# Altium schematic sheet 4G.SchDoc
size A2
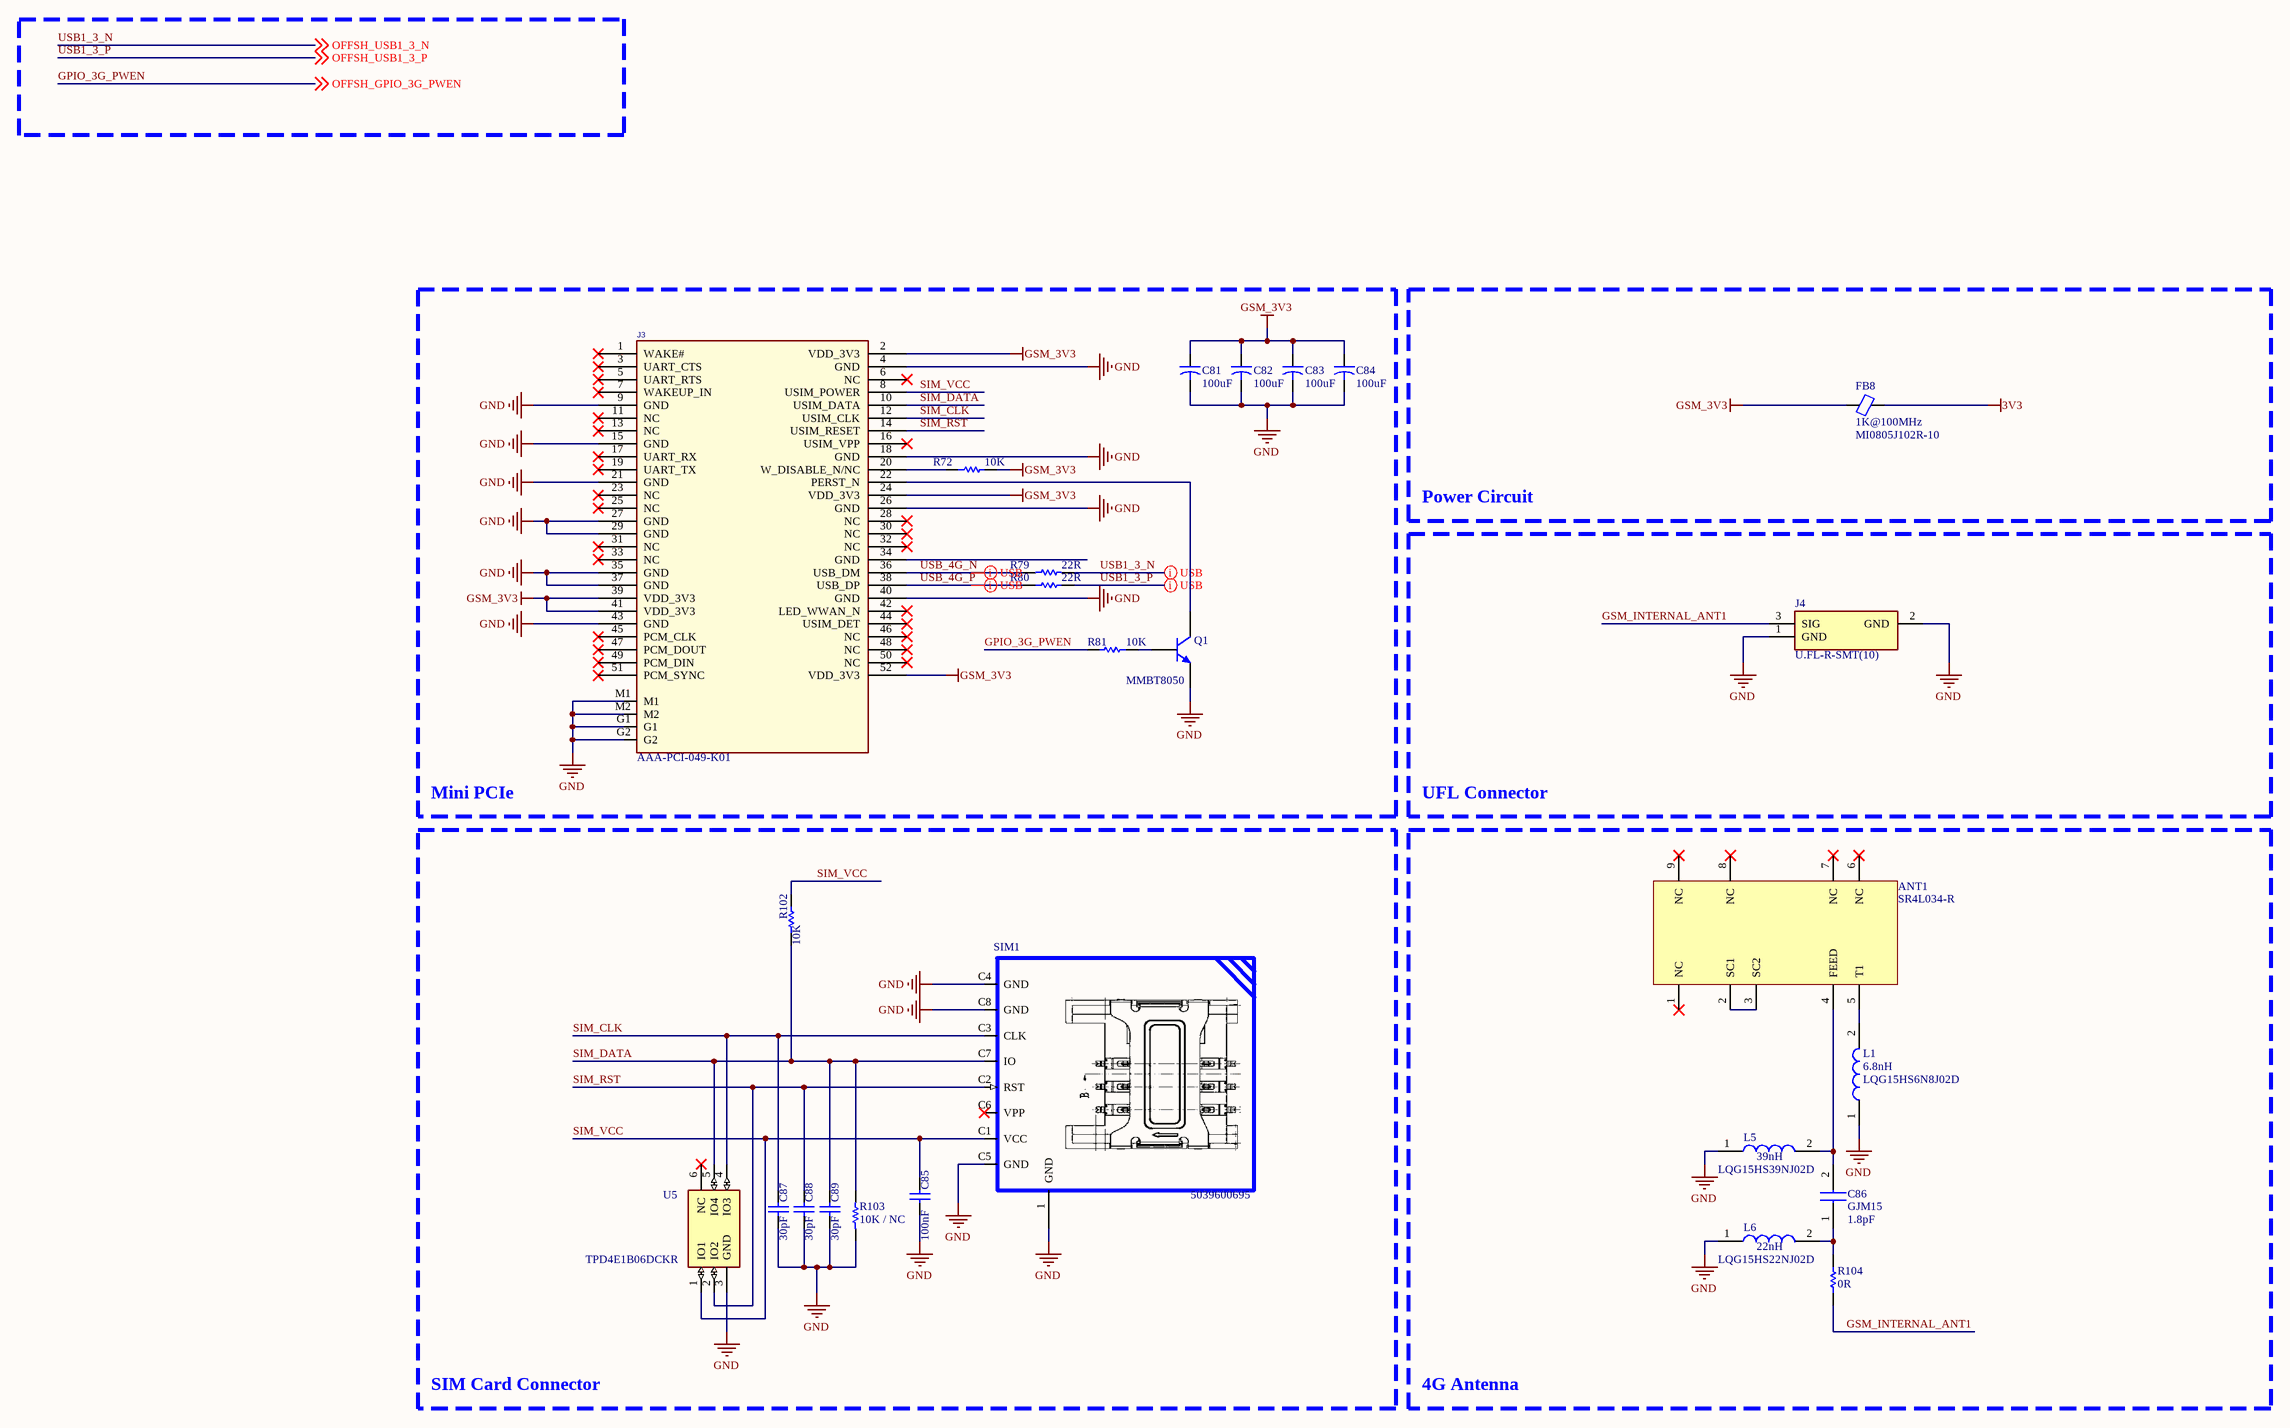
[diagram p0: 4G.SchDoc]

## Parts
ANT1  4G Antenna  [SR4L034-R]  (value not drawn)
C81  value 100uF  [TANTAL (SIZE B)]  (hidden comment: Cap_Tantal)
C82  value 100uF  [TANTAL (SIZE B)]  (hidden comment: Cap_Tantal)
C83  value 100uF  [TANTAL (SIZE B)]  (hidden comment: Cap_Tantal)
C84  value 100uF  [TANTAL (SIZE B)]  (hidden comment: Cap_Tantal)
C85  value 100nF  [CAP (0603)]  (hidden comment: Cap)
C86  GJM15  value 1.8pF  [GJM15]
C87  value 30pF  [CAP (0603)]  (hidden comment: Cap)
C88  value 30pF  [CAP (0603)]  (hidden comment: Cap)
C89  value 30pF  [CAP (0603)]  (hidden comment: Cap)
FB8  value 1K@100MHz  Part Number: MI0805J102R-10  [FB0603]  (hidden comment: Ferrite Bead)
J3  Part Number: AAA-PCI-049-K01  [MINI PCIE]  (hidden comment: Mini PCIe)
J4  U.FL  [UFLRSMT10]  (value not drawn)
L1  value 6.8nH  [LQG15HN]  (hidden comment: LQG15HS6N8J02D)
L5  value 39nH  [LQG15HN]  (hidden comment: LQG15HS39NJ02D)
L6  value 22nH  [LQG15HN]  (hidden comment: LQG15HS22NJ02D)
Q1  MMBT8050  [SOT95P237X111-3N (SOT23)]
R72  value 10K  [RES (0603)]  (hidden comment: Res)
R79  value 22R  [RES (0603)]  (hidden comment: Res)
R80  value 22R  [RES (0603)]  (hidden comment: Res)
R81  value 10K  [RES (0603)]  (hidden comment: Res)
R102  value 10K  [RES (0603)]  (hidden comment: Res)
R103  value 10K / NC  [RES (0603)]  (hidden comment: Res)
R104  value 0R  [RES (0603)]  (hidden comment: Res)
SIM1  Part Number: 5039600695  [Micro SIM Connector (5039600695)]  (hidden comment: Micro SIM Connector)
U5  ESD Protection  [SOT65P210X110-6N (SC70 6L)]  (value not drawn)

## Nets
3V3: FB8.2
GND: C81.2 C82.2 C83.2 C84.2 C85.1 C87.1 C88.1 C89.1 J3.4(GND) J3.9(GND) J3.15(GND) J3.18(GND) J3.21(GND) J3.26(GND) J3.27(GND) J3.29(GND) J3.35(GND) J3.37(GND) J3.40(GND) J3.43(GND) J3.G1 J3.G2 J3.M1 J3.M2 J4.1(GND) J4.2(GND) L1.1 L5.1 L6.1 Q1.2(E) R103.1 SIM1.1(GND) SIM1.C4(GND) SIM1.C5(GND) SIM1.C8(GND) U5.3(GND)
GSM_3V3: C81.1 C82.1 C83.1 C84.1 FB8.1 J3.2(VDD_3V3) J3.24(VDD_3V3) J3.39(VDD_3V3) J3.41(VDD_3V3) J3.52(VDD_3V3) R72.2
GPIO_3G_PWEN: R81.2 ; off-sheet OFFSH_GPIO_3G_PWEN  [also labelled OFFSH_GPIO_3G_PWEN]
GSM_INTERNAL_ANT1: J4.3(SIG) R104.1
SIM_CLK: C87.2 J3.12(USIM_CLK) SIM1.C3(CLK) U5.4(IO3)
SIM_DATA: C89.2 J3.10(USIM_DATA) R102.1 R103.2 SIM1.C7(IO) U5.5(IO4)
SIM_RST: C88.2 J3.14(USIM_RESET) SIM1.C2(RST) U5.2(IO2)
SIM_VCC: C85.2 J3.8(USIM_POWER) R102.2 SIM1.C1(VCC) U5.1(IO1)
USB1_3_N: R79.2 ; off-sheet OFFSH_USB1_3_N  [also labelled OFFSH_USB1_3_N]
USB1_3_P: R80.2 ; off-sheet OFFSH_USB1_3_P  [also labelled OFFSH_USB1_3_P]
USB_4G_N: J3.36(USB_DM) R79.1
USB_4G_P: J3.38(USB_DP) R80.1
NetANT1_2: ANT1.2(SC1) ANT1.3(SC2)
NetANT1_4: ANT1.4(FEED) C86.2 L5.2
NetANT1_5: ANT1.5(T1) L1.2
NetC86_1: C86.1 L6.2 R104.2
NetJ3_20: J3.20(W_DISABLE_N/NC) R72.1
NetJ3_22: J3.22(PERST_N) Q1.3(C)
NetQ1_1: Q1.1(B) R81.1

Not connected (* = marked no-connect by the designer): ANT1 1(NC)* 6(NC)* 7(NC)* 8(NC)* 9(NC)*; J3 1(WAKE#)* 3(UART_CTS)* 5(UART_RTS)* 6(NC)* 7(WAKEUP_IN)* 11(NC)* 13(NC)* 16(USIM_VPP)* 17(UART_RX)* 19(UART_TX)* 23(NC)* 25(NC)* 28(NC)* 30(NC)* 31(NC)* 32(NC)* 33(NC)* 34(GND) 42(LED_WWAN_N)* 44(USIM_DET)* 45(PCM_CLK)* 46(NC)* 47(PCM_DOUT)* 48(NC)* 49(PCM_DIN)* 50(NC)* 51(PCM_SYNC)*; SIM1 C6(VPP)*; U5 6(NC)*

## Layout directives
differential pair; net class USB: USB1_3_N, USB1_3_P, USB_4G_N, USB_4G_P

## Notes on the sheet
- Power Circuit
- Mini PCIe
- UFL Connector
- SIM Card Connector
- 4G Antenna

## Library data of the parts
ANT1 = SR4L034-R: LTE antenna / Berand        : antenova / partNo Left : SR4L034-L / PartNo Right: SR4L034-R; Link: https://www.digikey.sg/product-detail/en/antenova/SR4L034-R/627-1107-1-ND/9172247; Part Number: SR4L034-R
C81-C84 = Cap_Tantal: Tantalum Capacitor; Voltage: 10V
C85 C87-C89 = Cap: SMD capacitor; Voltage: 50V
C86 = GJM15: Murata Capacitor; Manufacturer_Name: Murata Electronics; Height: 0.55mm
FB8 = Ferrite Bead: Ferrite Bead SMD; Link: https://www.digikey.com/product-detail/en/laird-signal-integrity-products/MI0805J102R-10/240-2551-1-ND/1015989
J3 = Mini PCIe (AAA-PCI-049-K01): Link: https://lcsc.com/product-detail/Others_AAA-PCI-049-K01_C185938.html
J4 = U.FL-R-SMT(10): Coaxial Connectors U.FL; Manufacturer_Name: Hirose; Datasheet Link: https://media.digikey.com/pdf/Data%20Sheets/Hirose%20PDFs/UFL%20Series.pdf; Height: 1.25mm; Link: https://www.digikey.sg/product-detail/en/hirose-electric-co-ltd/U.FL-R-SMT-10/H9161CT-ND/2135256; Part Number: U.FL-R-SMT(10)
L1 = LQG15HS6N8J02D: Murata Inductor; Manufacturer_Name: Murata Electronics; Height: 0.55mm; Link: https://www.digikey.com/product-detail/en/murata-electronics/LQG15HS6N8J02D/490-2621-1-ND/662901; Part Number: LQG15HS6N8J02D
L5 = LQG15HS39NJ02D: Murata Inductor; Manufacturer_Name: Murata Electronics; Height: 0.55mm; Link: https://www.digikey.com/product-detail/en/murata-electronics/LQG15HS39NJ02D/490-2630-1-ND/662910; Part Number: LQG15HS39NJ02D
L6 = LQG15HS22NJ02D: Murata Inductor; Manufacturer_Name: Murata Electronics; Height: 0.55mm; Link: https://www.digikey.com/product-detail/en/murata-electronics/LQG15HS22NJ02D/490-2627-1-ND/662907; Part Number: LQG15HS22NJ02D
Q1 = MMBT8050: NPN General Purpose Amplifier; Link: https://www.alibaba.com/product-detail/100-MMBT8050-SOT-23-J3Y-S8050_60584077590.html; Part Number: MMBT8050
R72 R79-R81 R102-R104 = Res: SMD resistor; Tolerance: 5%
SIM1 = Micro SIM Connector (5039600695): Micro SIM Card Connector; Link: https://www.digikey.sg/product-detail/en/molex/5039600695/WM17882CT-ND/8572265
U5 = TPD4E1B06DCKR: Quad Bi-Directional ESD Protection Array; Manufacturer_Name: Texas Instruments; Datasheet Link: http://www.ti.com/jp/lit/gpn/tpd4e1b06; Height: 1.1mm; Link: https://www.digikey.sg/product-detail/en/texas-instruments/TPD4E1B06DCKR/296-39346-1-ND/5143298; Part Number: TPD4E1B06DCKR